# Altium schematic sheet 3.3V CAN Transciever.SchDoc
size A4
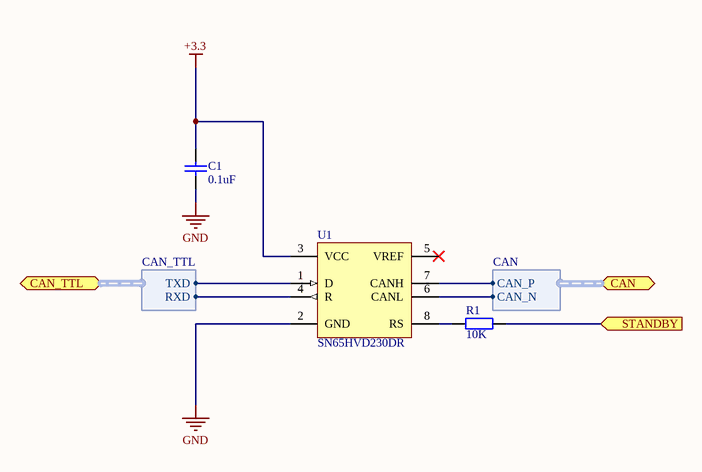
[diagram p0: 3.3V CAN Transciever.SchDoc]

## Parts
C1  value 0.1uF  [C0603]  (hidden comment: Cap)
R1  value 10K  [R0603]  (hidden comment: Res)
U1  SN65HVD230DR  [SN65HVD230DR]

## Ports
CAN (harness CAN), CAN_TTL (harness CAN_TTL), STANDBY (in)

## Harnesses
CAN_TTL: TXD, RXD
CAN: CAN_P, CAN_N

## Nets
+3.3: C1.1 U1.3(VCC)
GND: C1.2 U1.2(GND)
STANDBY: R1.1 ; port STANDBY
NetR1_2: R1.2 U1.8(RS)
NetU1_1: U1.1(D) ; port CAN_TTL.TXD
NetU1_4: U1.4(R) ; port CAN_TTL.RXD
NetU1_6: U1.6(CANL) ; port CAN.CAN_N
NetU1_7: U1.7(CANH) ; port CAN.CAN_P

Not connected (* = marked no-connect by the designer): U1 5(VREF)*

## Library data of the parts
C1 = Cap: Capacitor; farnell: 1759122
R1 = Res2: Resistor; farnell: 1576297
U1 = SN65HVD230DR: TEXAS INSTRUMENTS - SN65HVD230DR - TRANSCEIVER CAN, 65HVD230, SOIC8; farnell: 8452148